# EAGLE design Button-LED-Breakout-v11 (EAGLE 5.11)
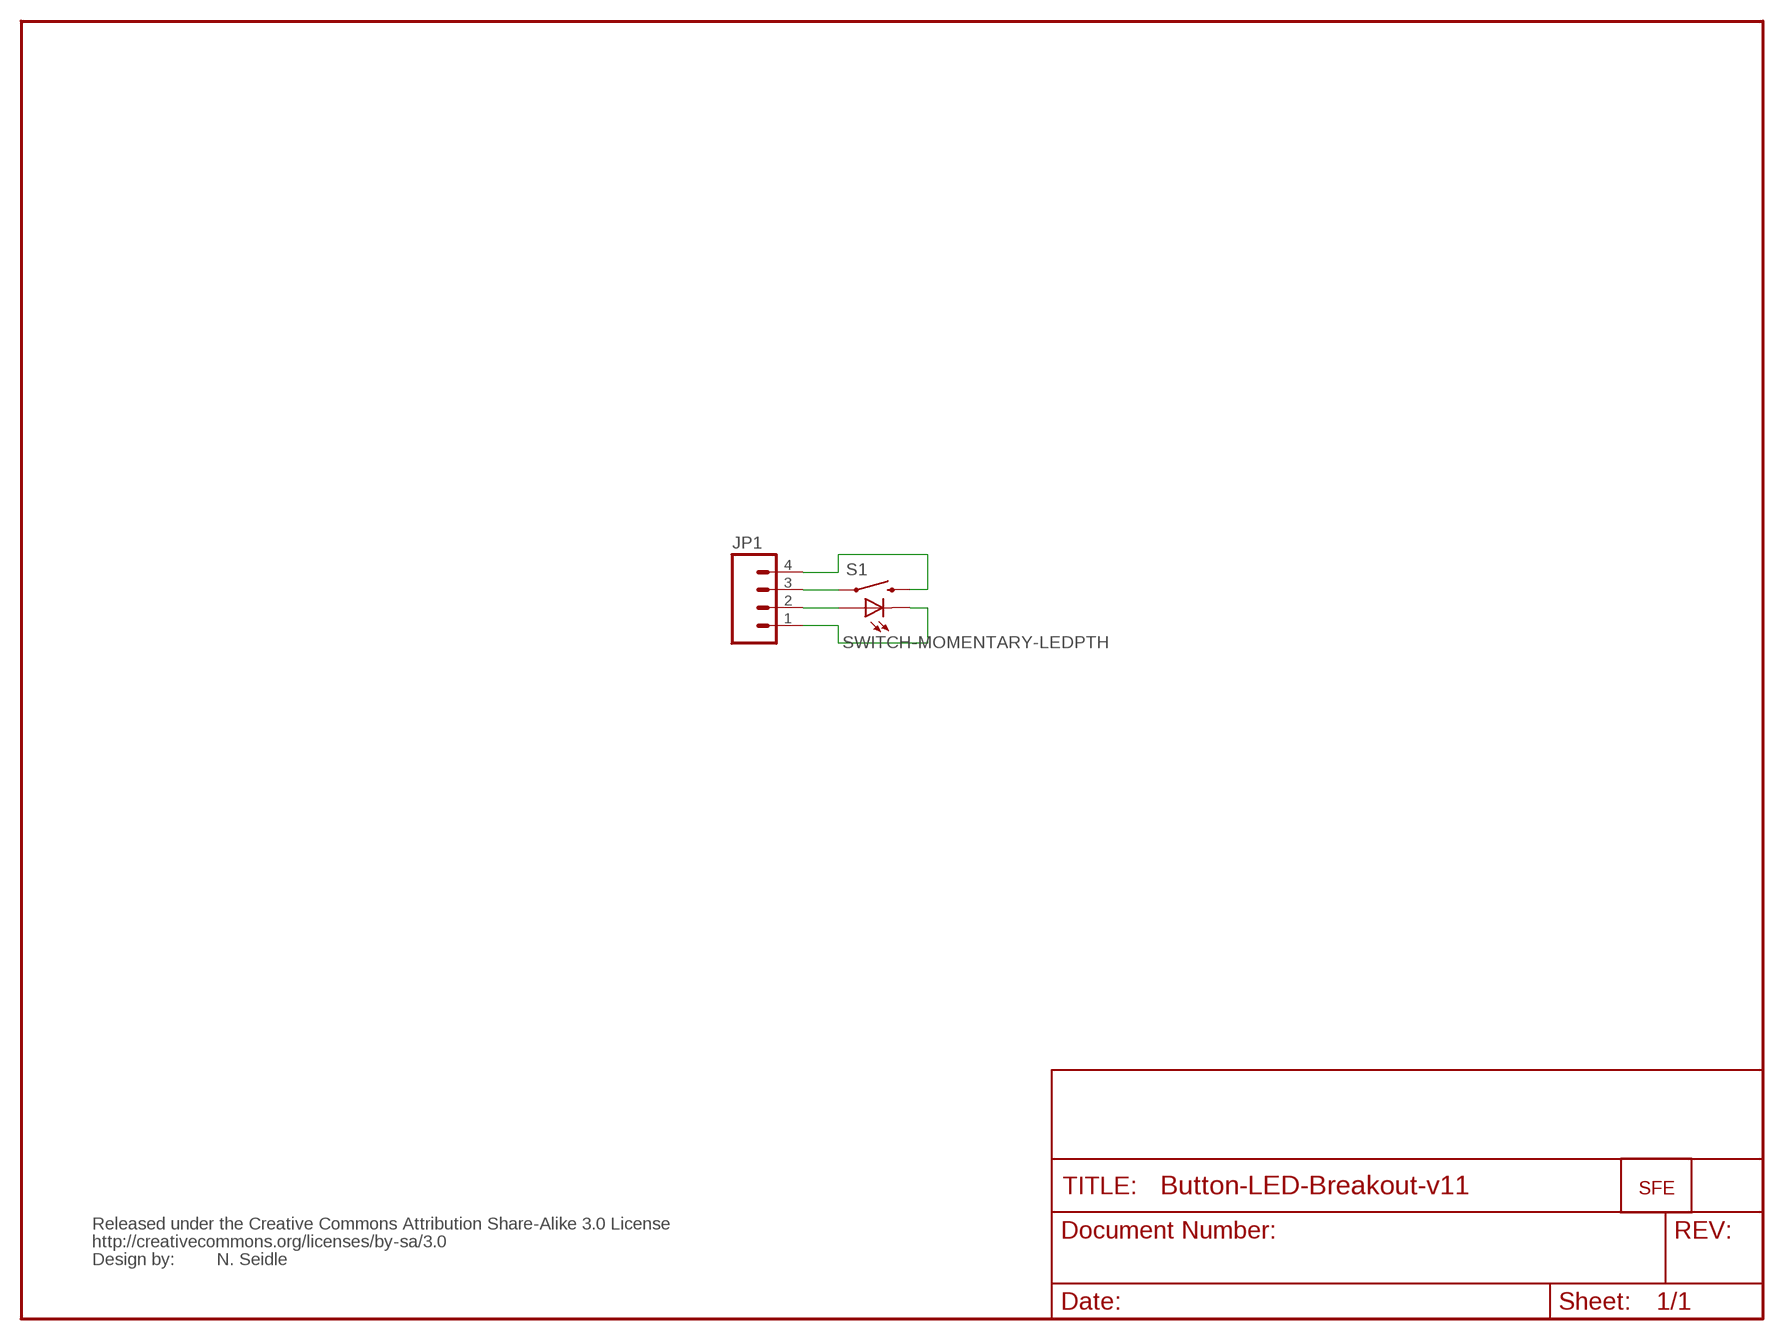
[diagram p0: schematic, sheet 1]

## Parts
JP1  M04PTH  [1X04]
JP2  LOGO-SFESK  [SFE-LOGO-FLAME]
S1  SWITCH-MOMENTARY-LEDPTH  [TACTILE-PTH-LED-12MM]
U$2  CREATIVE_COMMONS  [CREATIVE_COMMONS]

## Nets
N$1: JP1.4 S1.2
N$2: JP1.3 S1.4
N$3: JP1.2 S1.A
N$4: JP1.1 S1.C

## Notes on the sheet
- N. Seidle

## Library data of the parts
JP1 = SparkFun:M04: Header 4 Standard 4-pin 0.1" header. Use with straight break away headers (SKU : PRT-00116), right angle break away headers (PRT-00553), swiss pins (PRT-00743), machine pins (PRT-00117), and female headers (PRT-00115). Molex polarized connector foot print use with SKU : PRT-08231 with associated crimp pins and housings. 1MM SMD Version SKU: PRT-10208
JP2 = SparkFun:LOGO-SFE: Spark Fun Electronics PCB Logo This is the standard Spark Fun Electronics PCB logo.
S1 = Local Library:SWITCH-MOMENTARY-LED
U$2 = SparkFun:CREATIVE_COMMONS

## Board
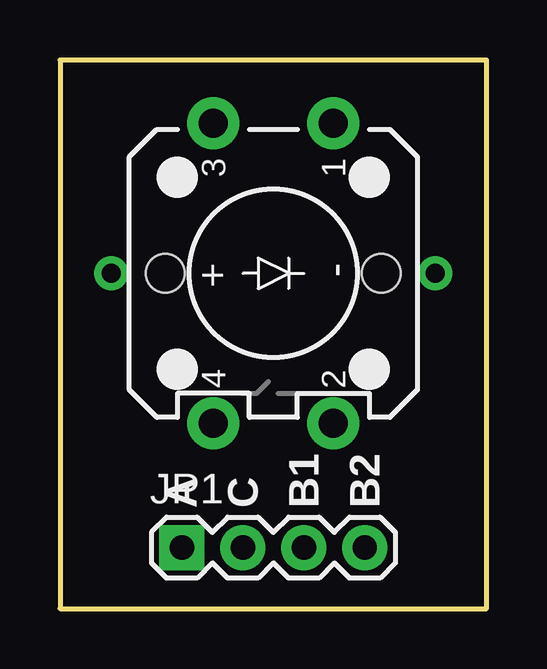
[diagram p1: board, top side]
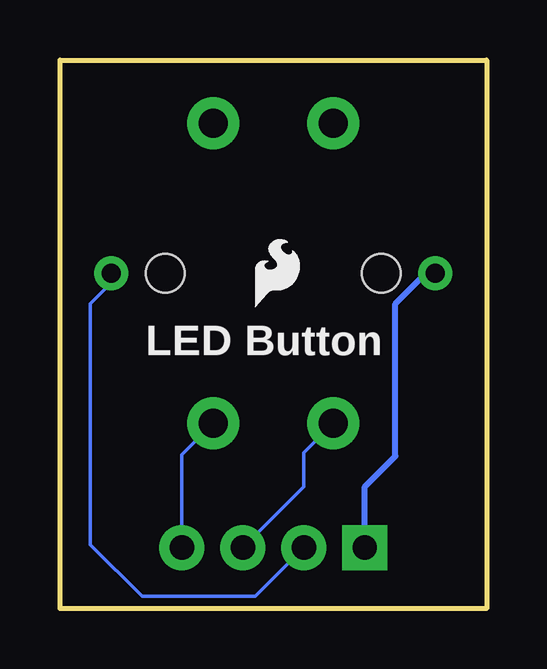
[diagram p2: board, bottom side, seen from below]

Size 17.78 x 22.86 mm. Coordinates in mm from the lower left corner, seen from the top.
Outline: 0,0 17.78,0 17.78,22.86 0,22.86 0,0
Copper layers (1*16): Top 0.0356mm / dielectric 1.5011mm / Bottom 0.0356mm
Design rules "default": minimum track width 8mil, minimum drill 20mil, track to track 8mil, track to pad 8mil, pad to pad 8mil, via to via 8mil, smd to smd 8mil, copper to edge 10mil, drill to drill 8mil, minimum pad ring 12mil, minimum via ring 10mil, stop-mask expansion 4mil, vias tented up to drill 20mil, thermal gap 10mil

### Footprints (pad centres in the part's own frame; a part is rotated, then mirrored left to right if it is on the bottom)
1X04 = drill 1.016 pad 1.88 square: 1 0,0 | drill 1.016 pad 1.88: 2 2.54,0; 3 5.08,0; 4 7.62,0
TACTILE-PTH-LED-12MM = drill 1.2 pad 2.159: 1 -6.25,2.5; 2 6.25,2.5; 3 -6.25,-2.5; 4 6.25,-2.5 | drill 0.8: A 0,6.75; C 0,-6.75 | hole 1.6: 0,4.5; 0,-4.5

### Placement (x,y rotation side)
JP1  5.08,2.54 0 top
JP2  9.65,12.57 0 bottom
S1  8.89,13.97 270 top
U$2  -16.51,-7.62 0 top  (outside the outline)

### Tracks (layer width: path | path; a pad name or v marks a point on that pad's centre or on a via)
N$1
  Top 0.254: 11.39,7.66 S1.2
  Bottom 0.152: S1.2 12.7,6.41 JP1.4
N$2
  Bottom 0.152: S1.4 7.62,6.49 7.62,5.08 JP1.3
N$3
  Bottom 0.152: S1.A 15.64,13.57 16.51,12.7 16.51,2.67 14.35,0.51 9.65,0.51 JP1.2
N$4
  Bottom 0.254: S1.C 2.54,13.97 3.81,12.7 3.81,6.35 5.08,5.08 JP1.1

### Text on the board
tPlace: A | C | B1 | B2
bPlace: LED Button